# EasyEDA schematic SCH_Flight-Computer-V4_2024-07-19.json
TITLE: Sheet_1; REV: 1.0; Date: 2024-07-19; Sheet: 1/1; Drawn By: usedgenes; Company: Your Company
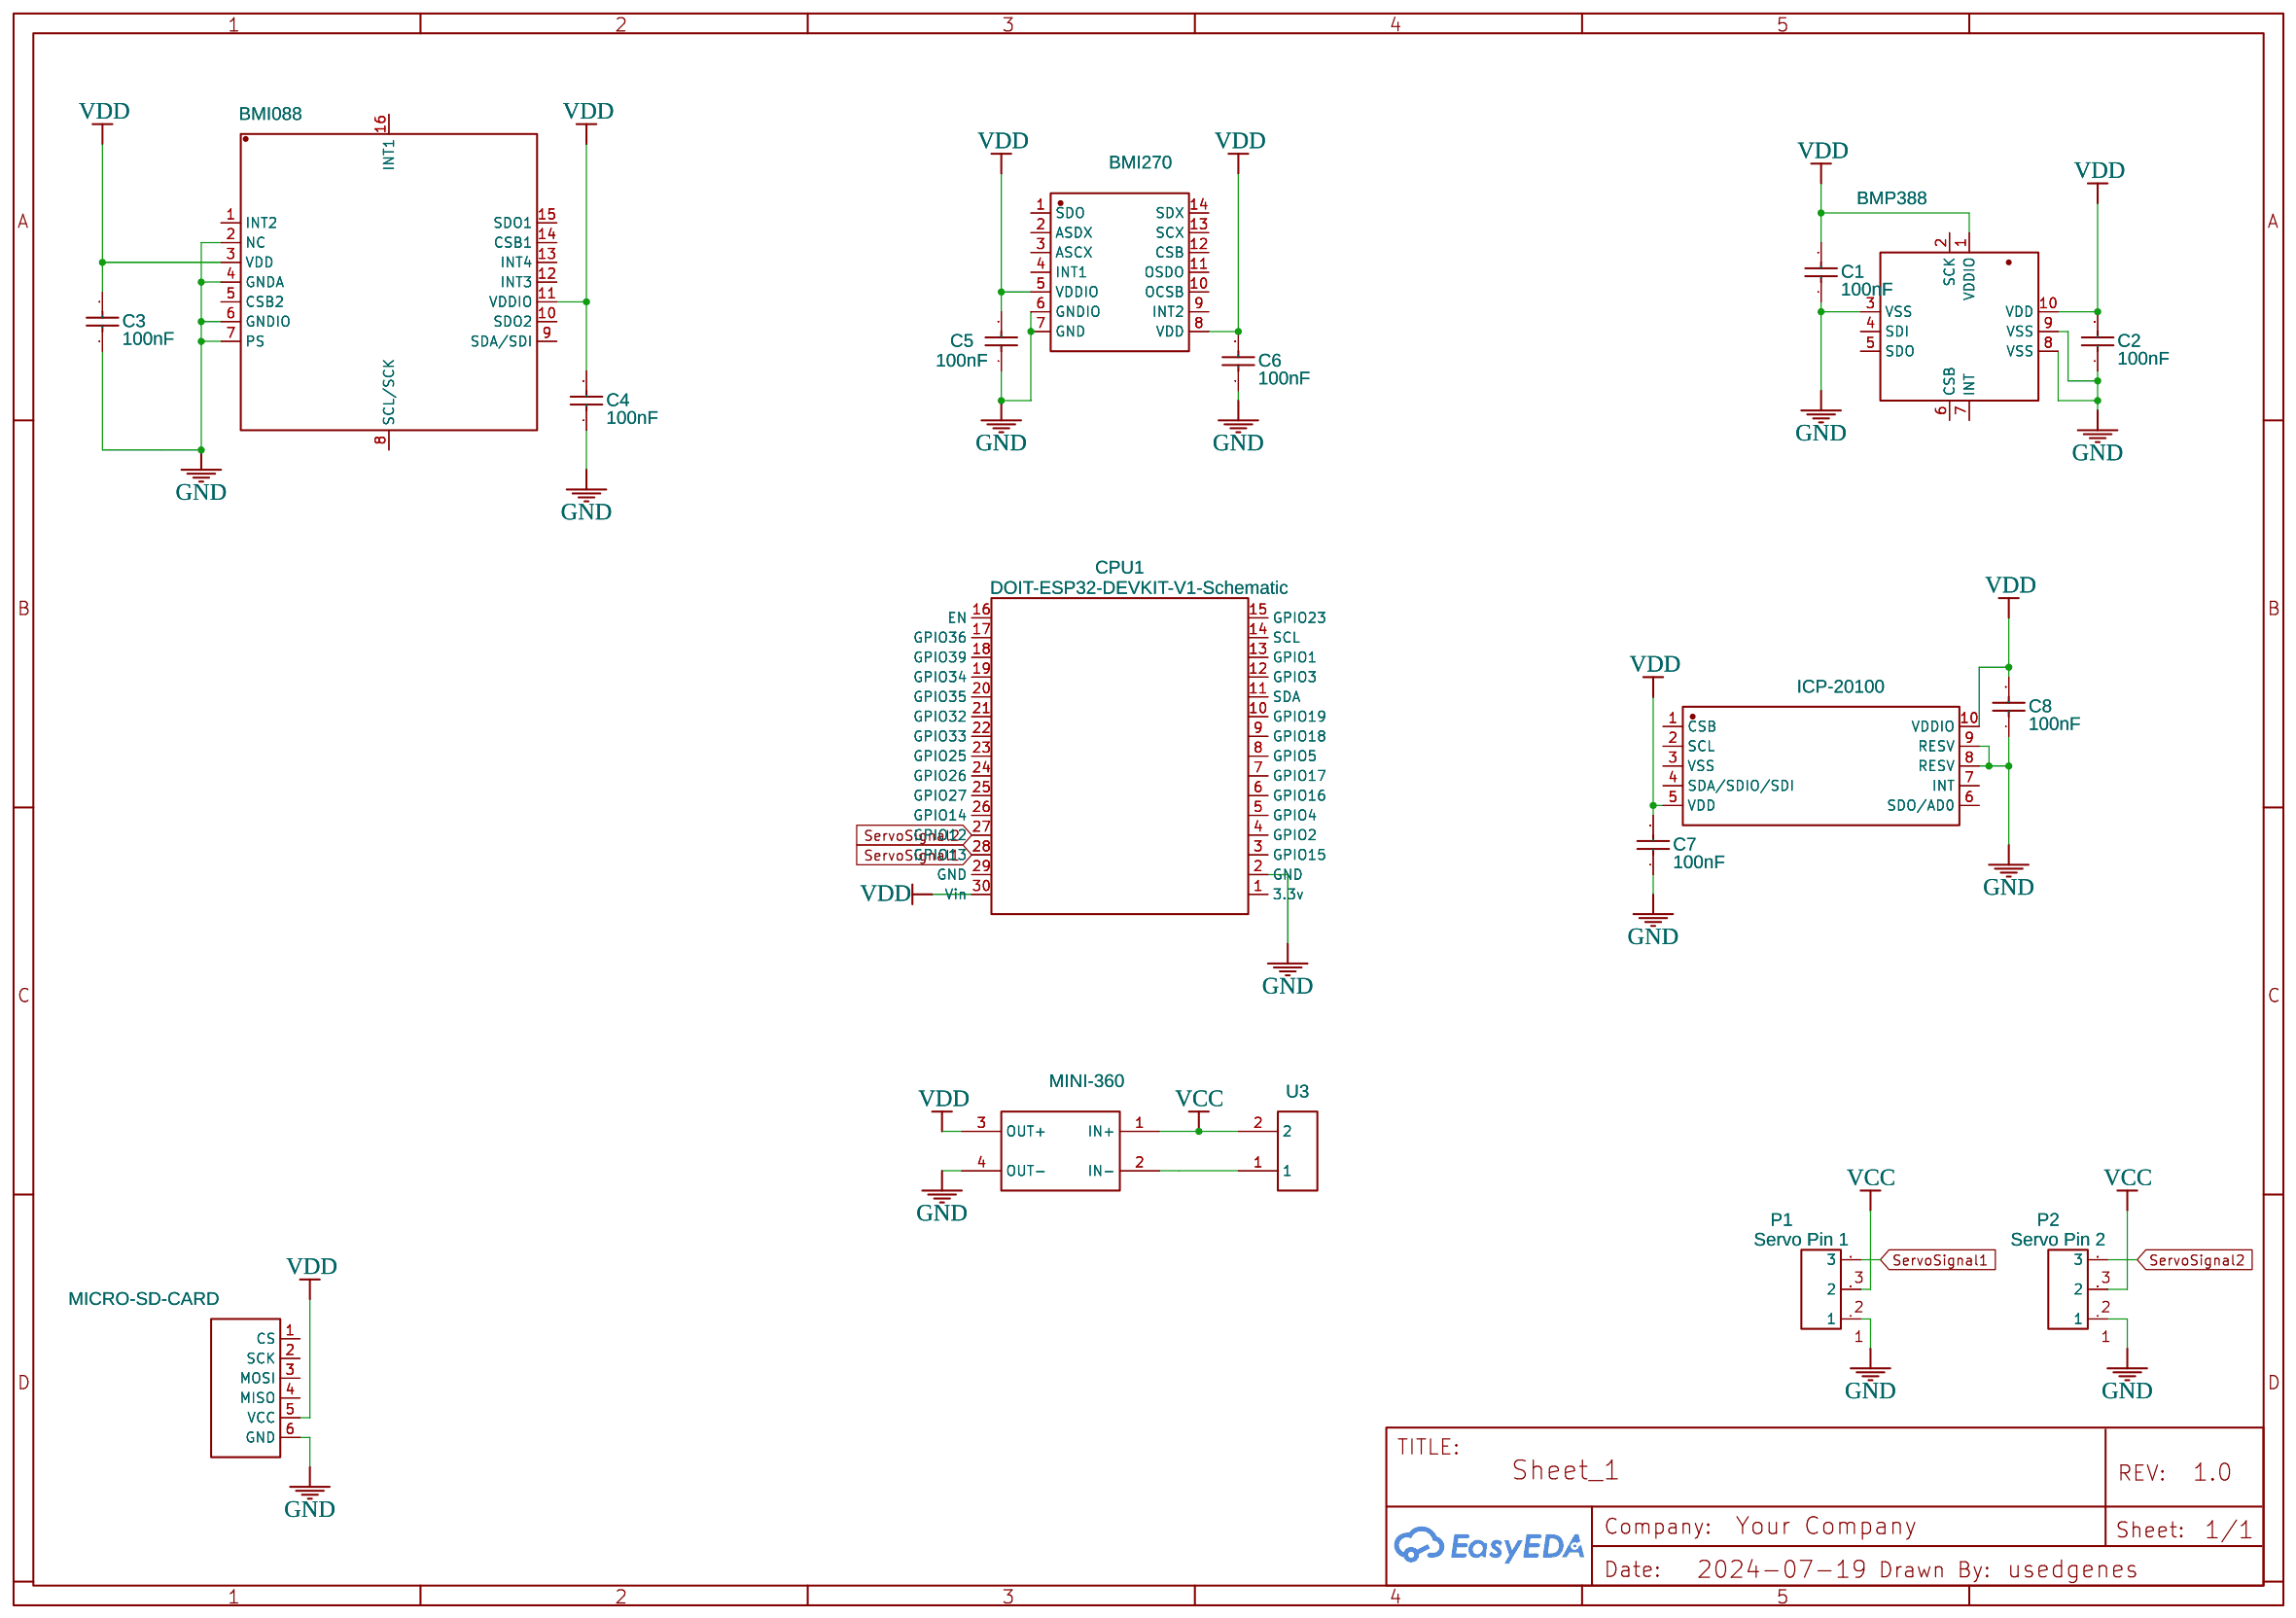
[diagram p0: schematic sheet]

## Parts
BMI088  BMI088  [LGA-16_L4.5-W3.0-P0.50-BL]
BMI270  BMI270  [LGA-14_L3.0-W2.5-P0.50-BR]
BMP388  BMP388  [SENSORM-SMD_BMP388]
C1  100nF  [C0402]
C2  100nF  [C0402]
C3  100nF  [C0402]
C4  100nF  [C0402]
C5  100nF  [C0402]
C6  100nF  [C0402]
C7  100nF  [C0402]
C8  100nF  [C0402]
CPU1  DOIT-ESP32-DEVKIT-V1-Schematic  [DOIT-ESP32-DEVKIT-V1]
ICP-20100  ICP-20100  [LGA-10_L2.0-W2.0-P0.50-TL_ICP-20100]
MICRO-SD-CARD  MicroSDCardAdapter  [MICROSDCARDADAPTER]
MINI-360  MINI-360  [DSN-MINI-360]
P1  Servo Pin 1  [CONNECTOR_PINHEADER_2.54MM:PINHEADER_1X3]
P2  Servo Pin 2  [CONNECTOR_PINHEADER_2.54MM:PINHEADER_1X3]
U3  Power Pins  [PIN HEADER CONNECTOR 1X2 PINS_PITCH 2.54MM]

## Library data of the parts
BMI088 = BMI088: Contributor: LCSC; Supplier: LCSC; Supplier Part: C194919; Manufacturer: Bosch(博世); JLCPCB Part Class: Extended Part
BMI270 = BMI270: Contributor: LCSC; Supplier: LCSC; Supplier Part: C2836813; Manufacturer: Bosch(博世); JLCPCB Part Class: Extended Part
BMP388 = BMP388: Contributor: LCSC; Supplier: LCSC; Supplier Part: C779278; Manufacturer: Bosch(博世); JLCPCB Part Class: Extended Part
C1-C8 = CL05B104KO5NNNC: Supplier: LCSC; Manufacturer: SAMSUNG(三星); Supplier Part: C1525; JLCPCB Part Class: Basic Part
CPU1 = DOIT-ESP32-DEVKIT-V1-Schematic: Manufacturer: NONE; Manufacturer Part: NONE; Supplier Part: NONE; link: NONE; Contributor: KaScada
ICP-20100 = ICP-20100: Supplier: LCSC; Supplier Part: C5343527; Manufacturer: TDK; JLCPCB Part Class: Extended Part; Contributor: lcsc
MICRO-SD-CARD = MicroSDCardAdapter: Contributor: dalewski; Package Display: No
MINI-360 = MINI-360: Contributor: RaspAutomacao
P1 P2 = HEADER PAD 3X RMM COPY: Supplier: LCSC; Manufacturer: BOOMELE; Manufacturer Part: Female headerHDR1X8-2.54; Supplier Part: C27438; JLCPCB Part Class: Extended Part; Contributor: blackhassio; Package Display: No
U3 = 1X2: Contributor: Ramsha

## Nets
GND: BMI088.2(NC) BMI088.4(GNDA) BMI088.6(GNDIO) BMI088.7(PS) BMI270.6(GNDIO) BMI270.7(GND) BMP388.3(VSS) BMP388.8(VSS) BMP388.9(VSS) C1.1 C2.1 C3.1 C4.1 C5.1 C6.1 C7.1 C8.1 CPU1.2(GND) ICP-20100.8(RESV) ICP-20100.9(RESV) MICRO-SD-CARD.6(GND) MINI-360.4(OUT-) P1.1 P2.1
VCC: MINI-360.1(IN+) P1.2 P2.2 U3.2
VDD: BMI088.3(VDD) BMI088.11(VDDIO) BMI270.5(VDDIO) BMI270.8(VDD) BMP388.1(VDDIO) BMP388.10(VDD) C1.2 C2.2 C3.2 C4.2 C5.2 C6.2 C7.2 C8.2 CPU1.30(Vin) ICP-20100.5(VDD) ICP-20100.10(VDDIO) MICRO-SD-CARD.5(VCC) MINI-360.3(OUT+)
ServoSignal1: CPU1.28(GPIO13) P1.3
ServoSignal2: CPU1.27(GPIO12) P2.3
Net-(MINI-360-2): MINI-360.2(IN-) U3.1

Not connected (* = marked no-connect by the designer): BMI088 1(INT2) 5(CSB2) 8(SCL/SCK) 9(SDA/SDI) 10(SDO2) 12(INT3) 13(INT4) 14(CSB1) 15(SDO1) 16(INT1); BMI270 1(SDO) 2(ASDX) 3(ASCX) 4(INT1) 9(INT2) 10(OCSB) 11(OSDO) 12(CSB) 13(SCX) 14(SDX); BMP388 2(SCK) 4(SDI) 5(SDO) 6(CSB) 7(INT); CPU1 1(3.3v) 3(GPIO15) 4(GPIO2) 5(GPIO4) 6(GPIO16) 7(GPIO17) 8(GPIO5) 9(GPIO18) 10(GPIO19) 11(SDA) 12(GPIO3) 13(GPIO1) 14(SCL) 15(GPIO23) 16(EN) 17(GPIO36) 18(GPIO39) 19(GPIO34) 20(GPIO35) 21(GPIO32) 22(GPIO33) 23(GPIO25) 24(GPIO26) 25(GPIO27) 26(GPIO14) 29(GND); ICP-20100 1(CSB) 2(SCL) 3(VSS) 4(SDA/SDIO/SDI) 6(SDO/AD0) 7(INT); MICRO-SD-CARD 1(CS) 2(SCK) 3(MOSI) 4(MISO)
